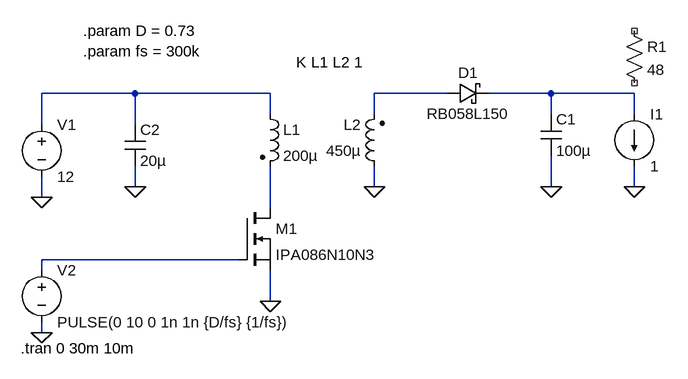
[diagram p0: schematic Flyback-CCM.asc]
Flyback-CCM.asc, the LTspice schematic file:
Version 4
SHEET 1 880 680
WIRE -32 -48 -176 -48
WIRE 176 -48 -32 -48
WIRE 448 -48 336 -48
WIRE 608 -48 512 -48
WIRE 736 -48 608 -48
WIRE 176 -16 176 -48
WIRE 336 -16 336 -48
WIRE 608 -16 608 -48
WIRE 736 -16 736 -48
WIRE -176 0 -176 -48
WIRE -32 0 -32 -48
WIRE -32 96 -32 64
WIRE 336 96 336 64
WIRE 608 96 608 48
WIRE 736 96 736 64
WIRE -176 112 -176 80
WIRE 176 128 176 64
WIRE 128 208 -176 208
WIRE -176 224 -176 208
WIRE 176 272 176 224
WIRE -176 320 -176 304
FLAG 176 272 0
FLAG -176 112 0
FLAG -176 320 0
FLAG -32 96 0
FLAG 336 96 0
FLAG 608 96 0
FLAG 736 96 0
SYMBOL ind2 160 -32 R0
SYMATTR InstName L1
SYMATTR Value 200µ
SYMATTR Type ind
SYMBOL ind2 352 80 R180
WINDOW 0 36 80 Left 2
WINDOW 3 36 40 Left 2
SYMATTR InstName L2
SYMATTR Value 450µ
SYMATTR Type ind
SYMBOL schottky 448 -32 R270
WINDOW 0 32 32 VTop 2
WINDOW 3 0 32 VBottom 2
SYMATTR InstName D1
SYMATTR Value RB058L150
SYMATTR Description Diode
SYMATTR Type diode
SYMBOL cap 592 -16 R0
SYMATTR InstName C1
SYMATTR Value 100µ
SYMBOL nmos 128 128 R0
SYMATTR InstName M1
SYMATTR Value IPA086N10N3
SYMBOL voltage -176 -16 R0
WINDOW 123 0 0 Left 0
WINDOW 39 0 0 Left 0
SYMATTR InstName V1
SYMATTR Value 12
SYMBOL voltage -176 208 R0
WINDOW 123 0 0 Left 0
WINDOW 39 0 0 Left 0
SYMATTR InstName V2
SYMATTR Value PULSE(0 10 0 1n 1n {D/fs} {1/fs})
SYMBOL res 720 -160 R0
SYMATTR InstName R1
SYMATTR Value 48
SYMBOL cap -48 0 R0
SYMATTR InstName C2
SYMATTR Value 20µ
SYMBOL current 736 -16 R0
WINDOW 123 0 0 Left 0
WINDOW 39 0 0 Left 0
SYMATTR InstName I1
SYMATTR Value 1
TEXT -208 344 Left 2 !.tran 0 30m 10m
TEXT 216 -96 Left 2 !K L1 L2 1
TEXT -112 -144 Left 2 !.param D = 0.73\n.param fs = 300k

The netlist it stands for:
* Flyback-CCM.asc
L1 N001 N004 200µ
L2 0 N002 450µ
D1 N002 N003 RB058L150
C1 N003 0 100µ
M1 N004 N005 0 0 IPA086N10N3
V1 N001 0 12
V2 N005 0 PULSE(0 10 0 1n 1n {D/fs} {1/fs})
R1 NC_01 NC_02 48
C2 N001 0 20µ
I1 N003 0 1
.model D D
.lib standard.dio
.model NMOS NMOS
.model PMOS PMOS
.lib standard.mos
.tran 0 30m 10m
K L1 L2 1
.param D = 0.73
.param fs = 300k
.backanno
.end